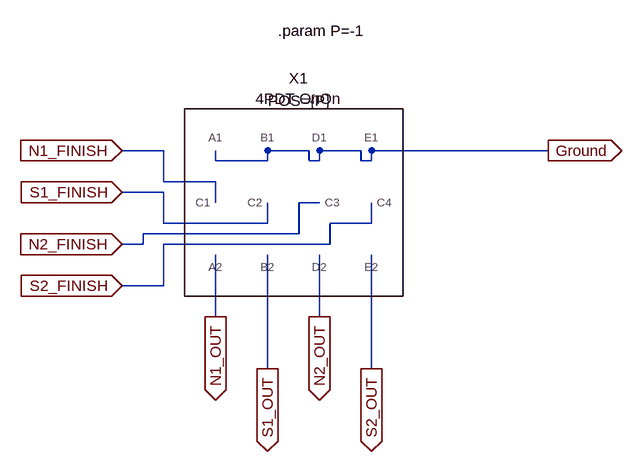
[diagram p0: schematic SplitCoil_4PDT.asc]
SplitCoil_4PDT.asc, the LTspice schematic file:
Version 4
SHEET 1 880 680
WIRE 16 112 -48 112
WIRE 240 112 176 112
WIRE 320 112 256 112
WIRE 608 112 336 112
WIRE 96 128 96 112
WIRE 176 128 176 112
WIRE 176 128 96 128
WIRE 240 128 240 112
WIRE 256 128 256 112
WIRE 256 128 240 128
WIRE 320 128 320 112
WIRE 336 128 336 112
WIRE 336 128 320 128
WIRE 16 160 16 112
WIRE 96 160 16 160
WIRE 16 176 -48 176
WIRE 96 192 96 160
WIRE 256 192 224 192
WIRE 16 224 16 176
WIRE 176 224 176 192
WIRE 176 224 16 224
WIRE 336 224 336 192
WIRE 336 224 272 224
WIRE 224 240 224 192
WIRE 224 240 -16 240
WIRE -16 256 -16 240
WIRE -16 256 -48 256
WIRE 272 256 272 224
WIRE 272 256 16 256
WIRE 16 320 16 256
WIRE 16 320 -48 320
WIRE 96 368 96 272
WIRE 256 368 256 272
WIRE 176 448 176 272
WIRE 336 448 336 272
FLAG 608 112 Ground
IOPIN 608 112 Out
FLAG -48 112 N1_FINISH
IOPIN -48 112 In
FLAG -48 176 S1_FINISH
IOPIN -48 176 In
FLAG -48 256 N2_FINISH
IOPIN -48 256 In
FLAG -48 320 S2_FINISH
IOPIN -48 320 In
FLAG 96 368 N1_OUT
IOPIN 96 368 Out
FLAG 176 448 S1_OUT
IOPIN 176 448 Out
FLAG 256 368 N2_OUT
IOPIN 256 368 Out
FLAG 336 448 S2_OUT
IOPIN 336 448 Out
SYMBOL 4PDT_OnOn 224 192 R0
WINDOW 39 1 -141 Bottom 2
SYMATTR InstName X1
SYMATTR SpiceLine POS={P}
TEXT 192 -72 Left 2 !.param P=-1

The netlist it stands for:
* SplitCoil_4PDT.asc
XX1 Ground N1_OUT Ground S1_OUT N1_FINISH S1_FINISH N2_FINISH S2_FINISH Ground N2_OUT Ground S2_OUT 4PDT OnOn POS={P}  ; pins A1 A2 B1 B2 C1 C2 C3 C4 D1 D2 E1 E2
.param P=-1
.backanno
.end